# EAGLE design V-00627-00 (EAGLE 7.2.0)
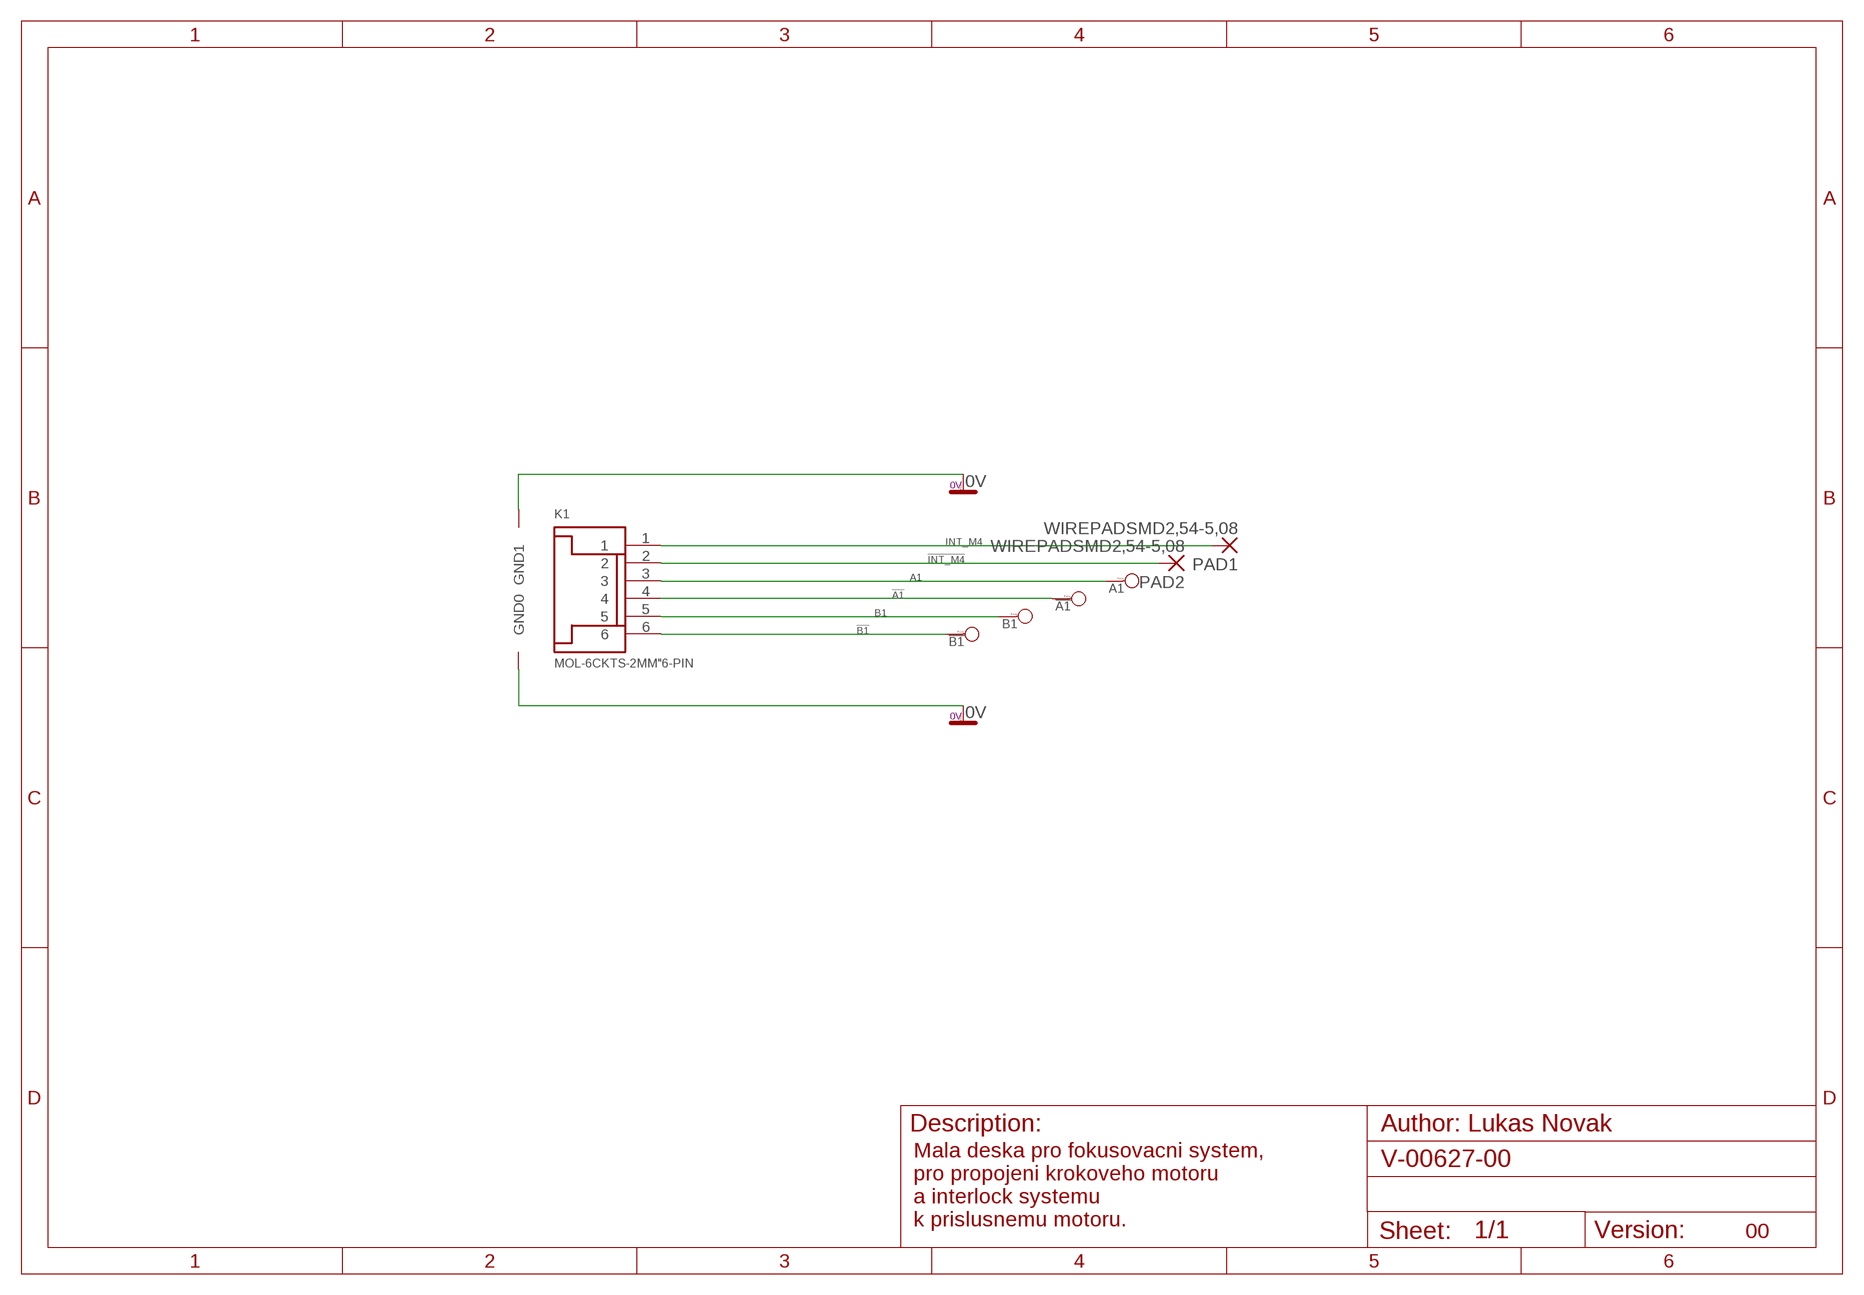
[diagram p0: schematic, sheet 1]

## Parts
!A1  PAD_1  [PAD_1]
!B1  PAD_1  [PAD_1]
A1  PAD_1  [PAD_1]
B1  PAD_1  [PAD_1]
K1  MOL-6CKTS-2MM"6-PIN  [6CKTS]
PAD1  WIREPADSMD2,54-5,08  [SMD2,54-5,08]
PAD2  WIREPADSMD2,54-5,08  [SMD2,54-5,08]

## Nets
0V: K1.GND0 K1.GND1
!A1: !A1.1 K1.4
!B1: !B1.1 K1.6
!INT_M4: K1.2 PAD2.1(P)
A1: A1.1 K1.3
B1: B1.1 K1.5
INT_M4: K1.1 PAD1.1(P)

## Notes on the sheet
- Mala deska pro fokusovacni system,
  pro propojeni krokoveho motoru
  a interlock systemu
  k prislusnemu motoru.
- 00

## Library data of the parts
!A1 !B1 A1 B1 = #PaJa_31:PAD_1: Pajeci bod - 2,54 mm prumer
K1 = LIC_All:MOL-6CKTS-2MM: DURACLIK™ 2.00MM (.079") PITCH WIRE-TO-BOARD CONNECTORS Specifications: • Housing: Receptacle PBT White, Header PBT Beige • Contact Plating: Tin • Voltage: 125V max. • Current: 3A max. Features: • Secure inner lock system • Wide/long end fitting solder nails • SMT tail protector • Positive lock with audible click Part NO.: 502351-0600
PAD1 PAD2 = wirepad:WIREPAD: Wire PAD connect wire on PCB

## Board
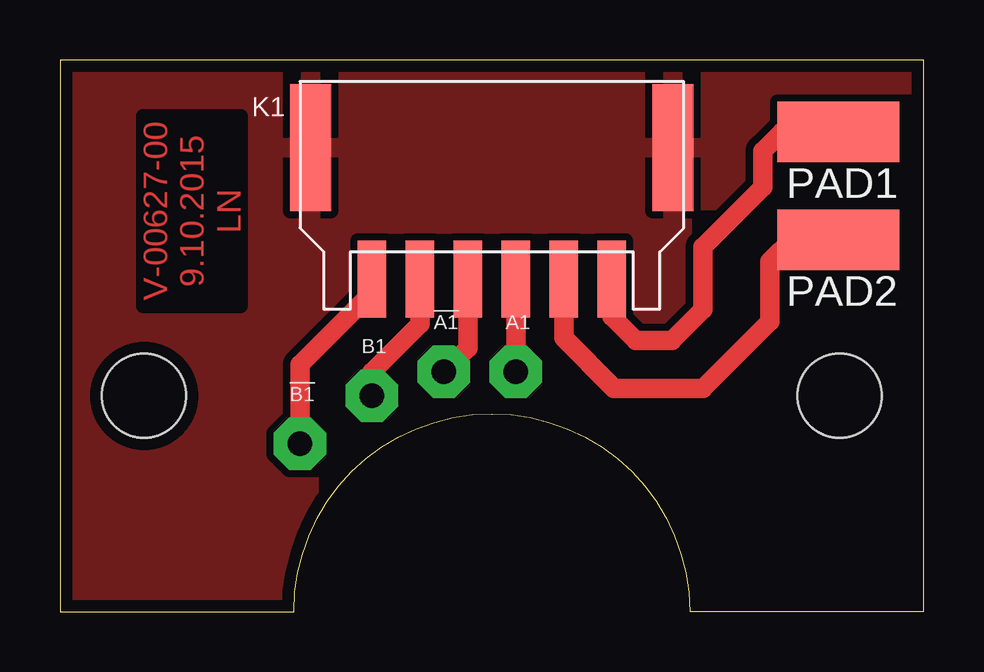
[diagram p1: board, top side]

Size 36 x 23 mm. Coordinates in mm from the lower left corner, seen from the top.
Outline: 36,0 36,23 0,23 0,0 9.75,0 arc-180 26.25,0 36,0
Copper layers (1*16): Top 0.04mm / dielectric 1.5mm / Bottom 0.04mm
Design rules "mucha_navrh": minimum track width 0.2mm, minimum drill 0.3mm, track to track 0.3mm, track to pad 0.3mm, pad to pad 0.3mm, via to via 0.3mm, smd to smd 0mil, copper to edge 0.5mm, drill to drill 0.5mm, minimum pad ring 0.3mm, minimum via ring 0.3mm, stop-mask expansion 0.1mm, vias tented up to drill 0.5mm, thermal gap 0.3mm
Holes 3.5 mm at 3.5,9 32.5,9
tRestrict: area 29,24.5 to 36,31.5; area 0,24.5 to 7,31.5

### Footprints (pad centres in the part's own frame; a part is rotated, then mirrored left to right if it is on the bottom)
PAD_1 = drill 1.016 pad 2.184 octagon: 1 0,0
6CKTS = smd 1.2 x 3.2: 1 -5,8.13; 2 -3,8.13; 3 -1,8.13; 4 1,8.13; 5 3,8.13; 6 5,8.13 | smd 1.7 x 5.3: GND0 -7.55,2.65; GND1 7.55,2.65
SMD2,54-5,08 = smd 2.54 x 5.08: 1 0,0

### Placement (x,y rotation side)
!A1  16,10 0 top
!B1  10,7 0 top
A1  19,10 0 top
B1  13,9 0 top
K1  18,22 180 top
PAD1  32.44,20 90 top
PAD2  32.44,15.5 90 top

### Tracks (layer width: path | path; a pad name or v marks a point on that pad's centre or on a via)
0V
  pour Top: 0,0 0,23 36,23 36,0
!A1
  Top 0.813: K1.4 17,11 !A1.1
!B1
  Top 0.813: K1.6 13,13.3 10,10.3 !B1.1
!INT_M4
  Top 0.813: K1.2 21,11.4 23.1,9.3 26.8,9.3 29.6,12.1 29.6,14.6 30.5,15.5 PAD2.1
A1
  Top 0.813: K1.3 A1.1
B1
  Top 0.813: K1.5 15,12 13,10 B1.1
INT_M4
  Top 0.813: K1.1 23,12.3 24,11.3 25.5,11.3 26.8,12.6 26.8,15.2 29.3,17.7 29.3,19.2 30.1,20 PAD1.1

### Text on the board
Top: V-00627-00 / 9.10.2015 / LN